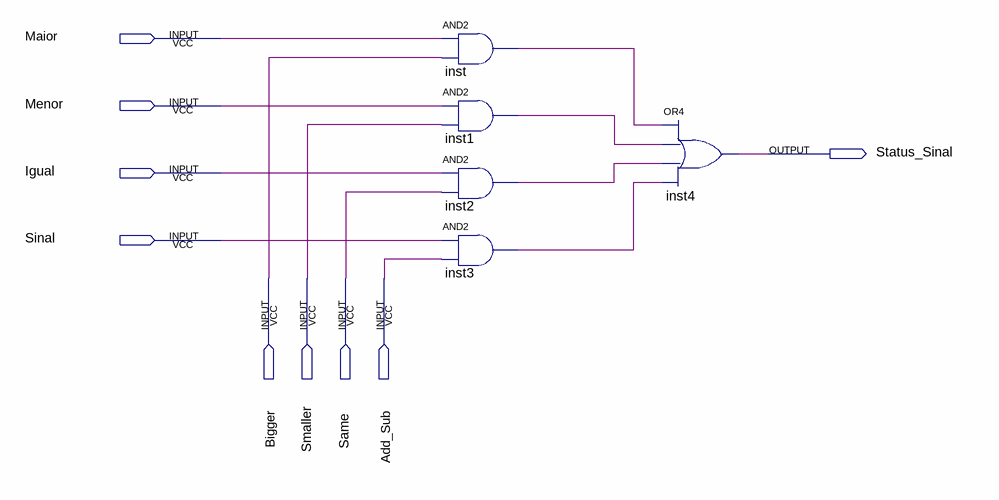
[diagram p0: schematic sheet]
// Quartus schematic MUX_Status_Sinal.bdf as structural Verilog: 5 symbols, 9 pins
module MUX_Status_Sinal (
  input  Maior,
  input  Menor,
  input  Igual,
  input  Sinal,
  input  Bigger,
  input  Smaller,
  input  Same,
  input  Add_Sub,
  output Status_Sinal
);

  wire inst1_out, inst2_out, inst3_out, inst_out;

  and inst (inst_out, Maior, Bigger);
  and inst1 (inst1_out, Menor, Smaller);
  and inst2 (inst2_out, Igual, Same);
  and inst3 (inst3_out, Sinal, Add_Sub);
  or inst4 (Status_Sinal, inst_out, inst1_out, inst2_out, inst3_out);
endmodule
